# Altium schematic sheet Battery_ECU.SchDoc
size 254 x 177 mm; SheetNumber: 1; SheetTotal: 1
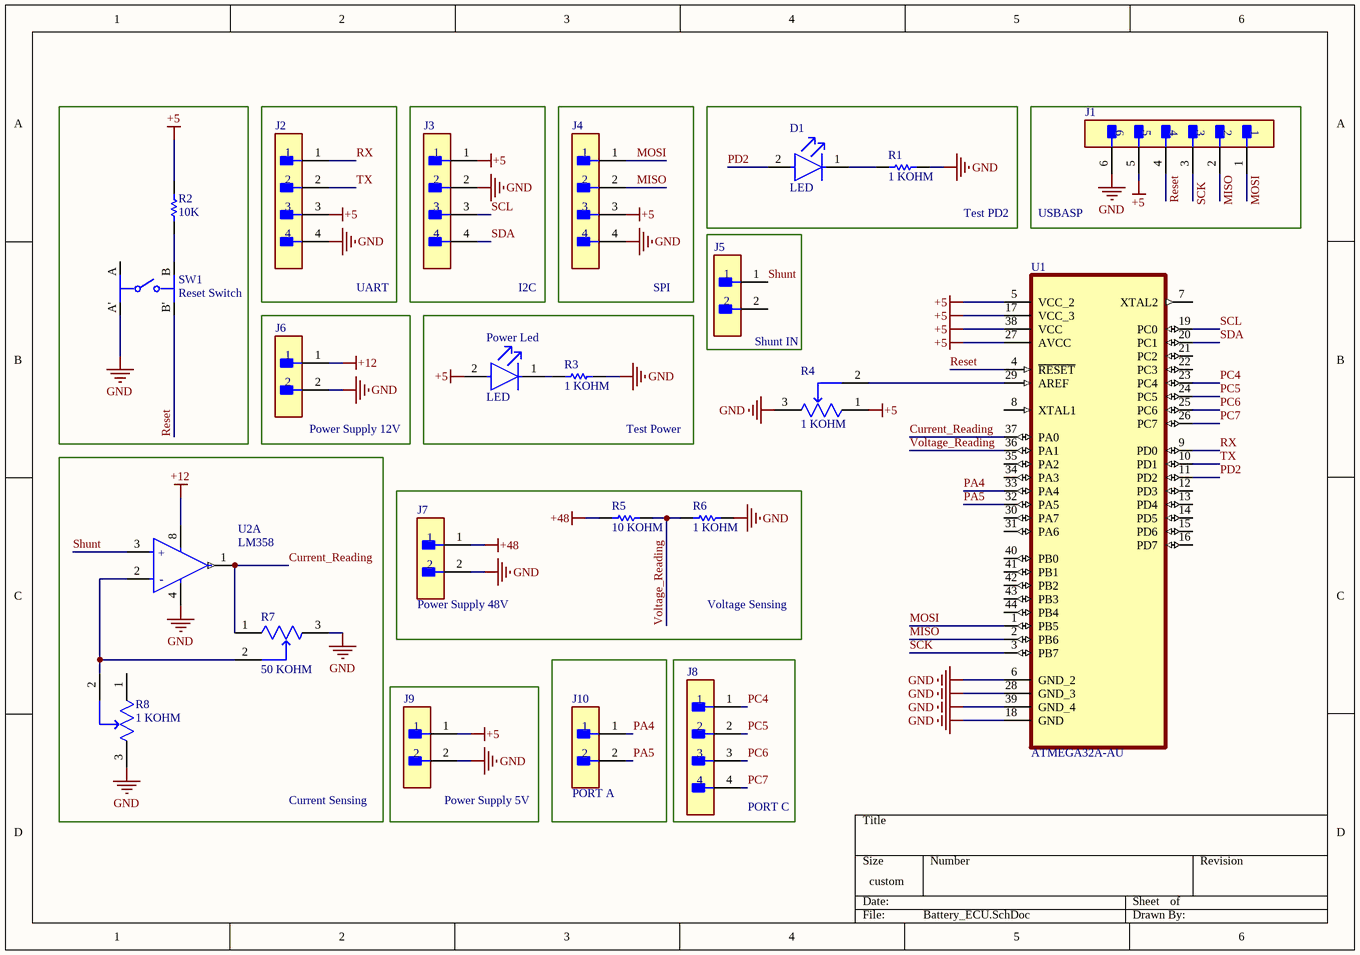
[diagram p0: Battery_ECU.SchDoc]

## Parts
D1  LED  [FP-LTST-C171GKT-MFG]
J1  USBASP  [FP-B6B-EH-A_LF_SN-MFG]
J2  UART  [FP-B04B-XASK-1_LF_SN-MFG]
J3  I2C  [FP-B04B-XASK-1_LF_SN-MFG]
J4  SPI  [FP-B04B-XASK-1_LF_SN-MFG]
J5  Shunt IN  [FP-B2B-XH-A_LF_SN-MFG]
J6  Power Supply 12V  [FP-B2B-XH-A_LF_SN-MFG]
J7  Power Supply 48V  [FP-B2B-XH-A_LF_SN-MFG]
J8  PORT C  [FP-B04B-XASK-1_LF_SN-MFG]
J9  Power Supply 5V  [FP-B2B-XH-A_LF_SN-MFG]
J10  PORT A  [FP-B2B-XH-A_LF_SN-MFG]
Power_Led  LED  [FP-LTST-C171GKT-MFG]
R1  1 KOHM  [RESC2013X60X35ML10T20]
R2  10K  [RESC2013X60X35ML10T20]
R3  1 KOHM  [RESC2013X60X35ML10T20]
R4  1 KOHM  [FP-3296W-MFG]
R5  10 KOHM  [RESC2013X60X35ML10T20]
R6  1 KOHM  [RESC2013X60X35ML10T20]
R7  50 KOHM  [FP-3296W-MFG]
R8  1 KOHM  [FP-3296W-MFG]
SW1  Reset Switch  [FP-EVQQ2Y02W-MFG]
U1  ATMEGA32A-AU  [QFP80P1200X1200X120-44N]
U2  LM358  [FP-751-07-IPC_C]  (part A of 2)

## Blocks framed on the sheet
Test PD2: D1 R1
Test Power: Power_Led R3
Current Sensing: R7 R8 U2
Voltage Sensing: J7 R5 R6

## Nets
+5: J1.5 J2.3 J3.1 J4.3 J9.1 Power_Led.2(A) R2.2 R4.1(CCW) U1.5(VCC_2) U1.17(VCC_3) U1.27(AVCC) U1.38(VCC)
+12: J6.1 U2.8(VCC)
+48: J7.1 R5.2
GND: J1.6 J2.4 J3.2 J4.4 J6.2 J7.2 J9.2 R1.2 R3.2 R4.3(CW) R6.1 R7.3(CW) R8.3(CW) SW1.A' U1.6(GND_2) U1.18(GND) U1.28(GND_3) U1.39(GND_4) U2.4(VEE/GND)
Current_Reading: R7.1(CCW) U1.37(PA0) U2.1(OUTPUT_A)
MISO: J1.2 J4.2 U1.2(PB6)
MOSI: J1.1 J4.1 U1.1(PB5)
PA4: J10.1 U1.33(PA4)
PA5: J10.2 U1.32(PA5)
PC4: J8.1 U1.23(PC4)
PC5: J8.2 U1.24(PC5)
PC6: J8.3 U1.25(PC6)
PC7: J8.4 U1.26(PC7)
PD2: D1.2(A) U1.11(PD2)
Reset: J1.4 SW1.B' U1.4(~{RESET})
RX: J2.1 U1.9(PD0)
SCK: J1.3 U1.3(PB7)
SCL: J3.3 U1.19(PC0)
SDA: J3.4 U1.20(PC1)
Shunt: J5.1 U2.3(INPUT_A+)
TX: J2.2 U1.10(PD1)
Voltage_Reading: R5.1 R6.2 U1.36(PA1)
NetD1_1: D1.1(C) R1.1
NetPower_Led_1: Power_Led.1(C) R3.1
NetR2_1: R2.1 SW1.B
NetR4_2: R4.2(WIPER) U1.29(AREF)
NetR7_2: R7.2(WIPER) R8.2(WIPER) U2.2(INPUT_A-)

Not connected (* = marked no-connect by the designer): J5 2; R8 1(CCW); SW1 A; U1 7(XTAL2) 8(XTAL1) 12(PD3) 13(PD4) 14(PD5) 15(PD6) 16(PD7) 21(PC2) 22(PC3) 30(PA7) 31(PA6) 34(PA3) 35(PA2) 40(PB0) 41(PB1) 42(PB2) 43(PB3) 44(PB4)

## Notes on the sheet
- (in symbol CMP-1310-00291-2, part A) +; -

## Library data of the parts
D1 Power_Led = CMP-22017-000007-1: LED GREEN CLEAR CHIP SMD; Luminous Intensity: 12mcd; Lens Color: Colorless; Dominant Wavelength: 569nm; Number of LEDs: 1; Power Dissipation: 100mW; Viewing Angle: 130°; Reverse Voltage: 5V; Test Current: 10mA; Forward Voltage: 2.1V; Wavelength: 585nm; Lens Style: Diffused; Forward Current: 30mA; Height: 0.8mm; Mount: Surface Mount; Package Quantity: 1; Length: 2mm; Case Code (Metric): 2012; Number of Pins: 2; Number of Elements: 1; Packaging: Tape and Reel; Color: Green; Min Operating Temperature: -55°C; Case/Package: 0805; Power Rating: 100mW; Max Operating Temperature: 85°C; Radiation Hardening: No; Depth: 1.25mm; Lens Transparency: Clear; Width: 1.25mm; Lead Free: Lead Free; Case Code (Imperial): 0805; Illumination Color: Green
J1 = CMP-17439-000293-1: CONN HEADER VERT 6POS 2.5MM; Voltage Rating: 250V; Number of Positions: 6; Current Rating: 3A; Mated Stacking Heights: 8.1mm; Gender: Male; Insulation Material: Nylon; Number of Contacts: 6; Contact Plating: Tin; Pitch: 2.5mm; Orientation: Straight; Insulation Color: Natural; Packaging: Bulk; Termination: Solder; Flammability Rating: UL94 V-0; Lead Free: Lead Free; Contact Mating Length: 0.13inch; Color: Natural; Contact Finish - Mating: TIN; Connector Type: Header; Contact Shape: Square; Contact Type: Male Pin; Series: EH; Contact Material: Brass; Fastening Type: Friction; Number of Rows: 1; Mount: Through Hole; Housing Color: White
J2-J4 J8 = CMP-17439-000018-1: CONN HEADER VERT 4POS 2.5MM; Manufacturer Part Number: B04B-XASK-1(LF)(SN); Manufacturer: JST; Current Rating: 3A; Voltage Rating: 250V; Conn Orientation: Straight; Conn Gender: Male; Number Of Contacts: 4; ComponentLink2Description: Datasheet; Package: B04B-XASK-1(LF)(SN); Octopart: https://octopart.com/b04b-xask-1%28lf%29%28sn%29-jst-3990149; Pitch: 2.5mm; Device Class L1: Connectors; RoHS: TRUE; Device Class L3: unset; Temperature Range High: +85°C; Height: 8.8mm; Lead Free: Yes; Category: Conn; Temperature: -25°C to +85°C; Digikey Description: CONN HEADER VERT 4POS 2.5MM; Temperature Range Low: -25°C; ComponentLink2URL: http://www.jst-mfg.com/product/pdf/eng/eXA1.pdf; Contact Material: Tin,Copper; Device Class L2: Headers and Wire Housings; Automotive: No; Number Of Rows: 1
J5-J7 J9 J10 = CMP-2000-05888-3: CONN HEADER VERT 2POS 2.5MM; Current Rating: 3A; Voltage Rating: 250V; Number of Contacts: 2; Contact Resistance: 20mR; Wire/Cable Gauge: 22AWG; Insulation Resistance: 1GR; Connector Type: Male Pin; Packaging: Bulk; Contact Material: Brass; Lead Free: Lead Free; Orientation: Straight; Contact Plating: Tin; Max Current Rating: 3A; Termination: Solder; Fastening Type: Detent; Depth: 5.75mm; Housing Material: Polyamide; REACH SVHC: No SVHC; Series: XH; Voltage Rating (AC): 250V; Number of Positions: 2; Color: Natural; Contact Type: Male Pin; Max Voltage Rating (DC): 250V; Pitch: 2.5mm; Lead Pitch: 2.5mm; Mount: Through Hole; Max Operating Temperature: 85°C; Length: 7.4mm; Max Voltage Rating (AC): 250V; Min Operating Temperature: -25°C; Number of Rows: 1; Housing Color: White
R1-R3 R5 R6 = CMP-2100-03673-1: Chip Resistor, 0 Ohm, Jumper, +/- 5%, 0.125 W, -55 to 155 degC, 0805 (2012 Metric), RoHS, Tape and Reel; Manufacturer: Yageo; Power Rating: 125mW; Resistance: 0mOhm; Voltage Rating (DC): 150V; Temperature Coefficient: 200ppm/degreesC; Height: 0.5mm; Depth: 1.25mm; Case Code (Imperial): 0805; Lead Free: LeadFree; Military Standard: Not; Package Description: 2-Pin Surface Mounted Device, Body 2 x 1.25 mm; Case Code (Metric): 2012; Composition: ThickFilm; Voltage Rating: 150V; Manufacturer URL: http://www.yageo.com/; Packaging: TapeandReel; Package Reference: 0805; REACH SVHC: Unknown; Tolerance: 5%; Case/Package: 0805; Max Operating Temperature: 155degC; Number of Pins: 2; Min Operating Temperature: -55degC; RoHSCompliant: true; Length: 2mm; Datasheet URL: http://www.yageo.com/NewPortal/yageodocoutput?fileName=/pdf/R-Chip/PYu-RC_Group_51_RoHS_L_5.pdf; Termination: SMD/SMT; Radiation Hardening: No; Width: 1.25mm; Contact Plating: Tin; Datasheet Version: Rev. 5, 10/2016
R4 R7 R8 = CMP-2000-05583-2: TRIMMER 500K OHM 0.5W PC PIN TOP; Manufacturer: Bourns; Manufacturer Part Number: 3296W-1-504LF; Resistance: 500kΩ; Temperature Coefficient: 100ppm/°C; Value: 500kΩ; Tolerance: 10%; Voltage Rating: 300V; Standoff Height: 0.38mm; ComponentLink2Description: Datasheet; Package: 3296W; Series: Trimpot 3296-Sealed; Lead Free: Yes; Octopart: https://octopart.com/3296w-1-504lf-bourns-143884; Device Class L2: Resistors; Automotive: No; RoHS: TRUE; Temperature Range High: +125°C; Height: 12.05mm; Power Rating: 0.5W; Temperature Range Low: -55°C; ComponentLink2URL: https://www.bourns.com/docs/Product-Datasheets/3296.pdf; Device Class L1: Passive Components; Device Class L3: Variable Resistors and Potentiometers; Category: Res; Temperature: -55°C to +125°C; Digikey Description: TRIMMER 500K OHM 0.5W PC PIN TOP; Mouser Description: Trimmer; Cermet; Rest 500 Kilohms; PCB; 25 Turns; Pwr-Rtg 0.5W
SW1 = CMP-05618-000018-2: SWITCH TACTILE SPST-NO 0.02A 15V; NexarPartId: 47192941; Illumination Type: Illuminated, Non-Illuminated; Contact Current Rating: 20mA; Mechanical Life: 100kcycles; Number of Positions: 2; Switch Function: Off-Mom; Voltage Rating (AC): 250V; Operating Force: 3.5N; Actuator Length: 700µm; Throw Configuration: SPST; Switch Travel: 250µm; Contact Resistance: 100mΩ; Max Operating Temperature: 85°C; Max Voltage Rating (DC): 15V; REACH SVHC: Unknown; Length: 6.5mm; Orientation: Straight; RoHS: Compliant; Min Operating Temperature: -40°C; Current Rating: 20mA; Radiation Hardening: No; Electrical Life: 100kcycles; Termination: SMD/SMT; Mount: Surface Mount; Voltage Rating (DC): 15V; Contact Plating: Silver; Thickness: 1.8mm; Color: White; Case/Package: SMD/SMT; Width: 6mm; Lead Free: Lead Free; Height: 2.5mm
U1 = ATMEGA32A-AU: AVR AVRÂ® ATmega Microcontroller IC 8-Bit 16MHz 32KB (16K x 16) FLASH 44-TQFP (10x10); MF: Microchip; SnapEDA_Link: https://www.snapeda.com/parts/ATMEGA32A-AU/Microchip/view-part/?ref=snap; Package: TQFP-44 Microchip; Value: *; MP: ATMEGA32A-AU; Check_prices: https://www.snapeda.com/parts/ATMEGA32A-AU/Microchip/view-part/?ref=eda
U2 = CMP-1310-00291-2: IC OPAMP GP 2 CIRCUIT 8SOIC; Gain Bandwidth Product: 1MHz; Number of Circuits: 2; Min Supply Voltage: 3V; Slew Rate: 0.6V/µs; Max Dual Supply Voltage: 16V; Common Mode Rejection Ratio: 65dB; Input Bias Current: 250nA; Min Dual Supply Voltage: 1.5V; Dual Supply Voltage: 9V; Operating Supply Current: 1.5mA; Output Current: 40mA; Input Offset Voltage (Vos): 7mV; Nominal Supply Current: 1.2mA; Voltage Gain: 100dB; Max Supply Voltage: 32V; Width: 4mm; Number of Pins: 8; Min Operating Temperature: 0°C; REACH SVHC: No SVHC; Contact Plating: Tin; Lead Free: Lead Free; Halogen Free: Halogen Free; Power Supply Rejection Ratio (PSRR): 65dB; Operating Supply Voltage: 16V; Package Quantity: 2500; Max Operating Temperature: 70°C; Case/Package: SOIC; Height: 1.5mm; Packaging: Tape and Reel; Radiation Hardening: No; Number of Channels: 2; Bandwidth: 1MHz; Length: 5mm; Number of Elements: 2; Number of Amplifiers: 2; Output Current per Channel: 40mA